# EAGLE design output stage (EAGLE 9.3.1)
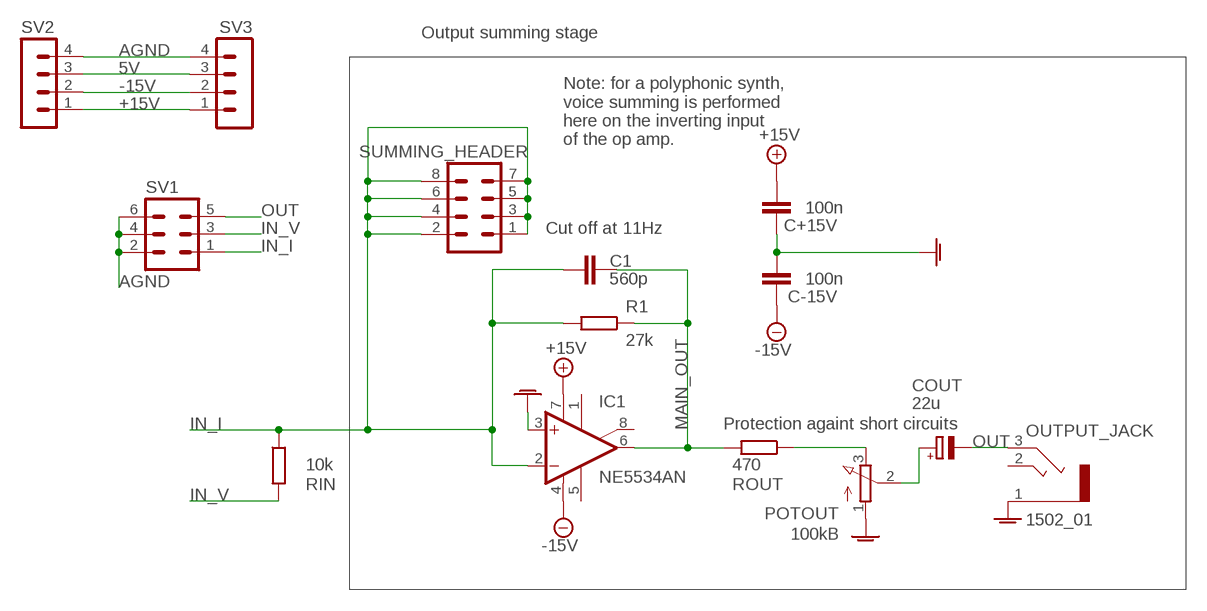
[diagram p0: schematic, sheet 1]

## Parts
C1  560p  C-EU075-032X103  [C075-032X103]
C+15V  100n  C-EU075-032X103  [C075-032X103]
C-15V  100n  C-EU075-032X103  [C075-032X103]
COUT  22u  CPOL-EUB45181A  [B45181A]
IC1  NE5534AN  [DIL08]
OUTPUT_JACK  1502_01  [1502_01]
POTOUT  100kB  3RP/1610N  [3RP/1610N]
R1  27k  R-EU_0207/10  [0207/10]
RIN  10k  R-EU_0207/10  [0207/10]
ROUT  470  R-EU_0207/12  [0207/12]
SUMMING_HEADER  MA04-2  [MA04-2]
SV1  MA03-2  [MA03-2]
SV2  MA04-1  [MA04-1]
SV3  MA04-1  [MA04-1]

## Nets
5V: SV2.3 SV3.3
+15V: C+15V.2 IC1.7(V+) SV2.1 SV3.1
-15V: C-15V.1 IC1.4(V-) SV2.2 SV3.2
AGND: C+15V.1 C-15V.2 IC1.3(+IN) OUTPUT_JACK.1 POTOUT.1(A) SV1.2 SV1.4 SV1.6 SV2.4 SV3.4
IN_I: C1.2 IC1.2(-IN) R1.2 RIN.1 SUMMING_HEADER.1 SUMMING_HEADER.2 SUMMING_HEADER.3 SUMMING_HEADER.4 SUMMING_HEADER.5 SUMMING_HEADER.6 SUMMING_HEADER.7 SUMMING_HEADER.8 SV1.1
IN_V: RIN.2 SV1.3
MAIN_OUT: C1.1 IC1.6(OUT) R1.1 ROUT.2
N$8: COUT.+ POTOUT.2(S)
N$9: POTOUT.3(E) ROUT.1
OUT: COUT.- OUTPUT_JACK.3 SV1.5
Unconnected: IC1.1(ON) IC1.5(CMP) IC1.8(ON/CMP) OUTPUT_JACK.2

## Notes on the sheet
- Output summing stage
- Note: for a polyphonic synth, 
  voice summing is performed 
  here on the inverting input 
  of the op amp.
- Cut off at 11Hz
- Protection againt short circuits

## Library data of the parts
C1 C+15V C-15V = rcl:C-EU: CAPACITOR, European symbol; SPICEPREFIX: C
COUT = resistor:CPOL-EU: POLARIZED CAPACITOR, European symbol
IC1 = linear:NE5534: LOW-NOISE OPERATIONAL AMPLIFIER Source: http://focus.ti.com/lit/ds/symlink/ne5534.pdf
OUTPUT_JACK = con-lumberg:1502_01: Jack connectors according to JISC 6560, 3.5 mm Klinkensteckverbinder nach JISC 6560, 3,5 mm Source: http://www.lumberg.com/Produkte/PDFs/1502_01.pdf; OC_FARNELL: 4739747; OC_NEWARK: unknown
POTOUT = pot:3RP/1610N: 16mm Potentiometer one level Source: http://www.alphapotentiometers.net/html/16mm_pot_2.html
R1 RIN ROUT = rcl:R-EU_: RESISTOR, European symbol; SPICEPREFIX: R
SUMMING_HEADER = con-lstb:MA04-2: PIN HEADER; OC_FARNELL: unknown; OC_NEWARK: unknown
SV1 = con-lstb:MA03-2: PIN HEADER; OC_FARNELL: unknown; OC_NEWARK: unknown
SV2 SV3 = con-lstb:MA04-1: PIN HEADER; OC_FARNELL: unknown; OC_NEWARK: unknown

## Board
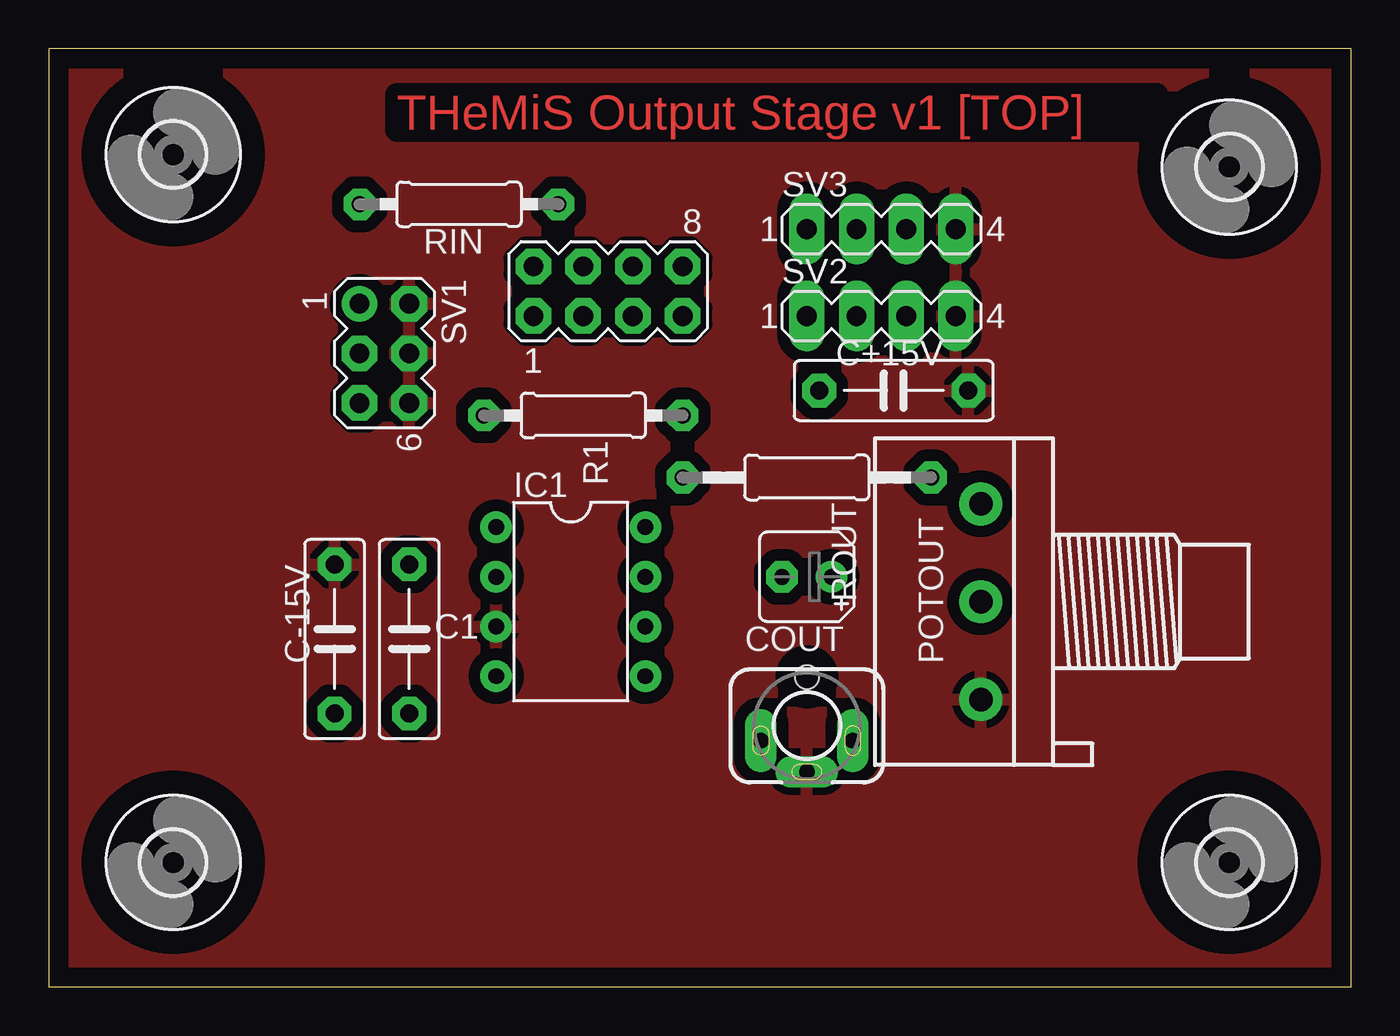
[diagram p1: board, top side]
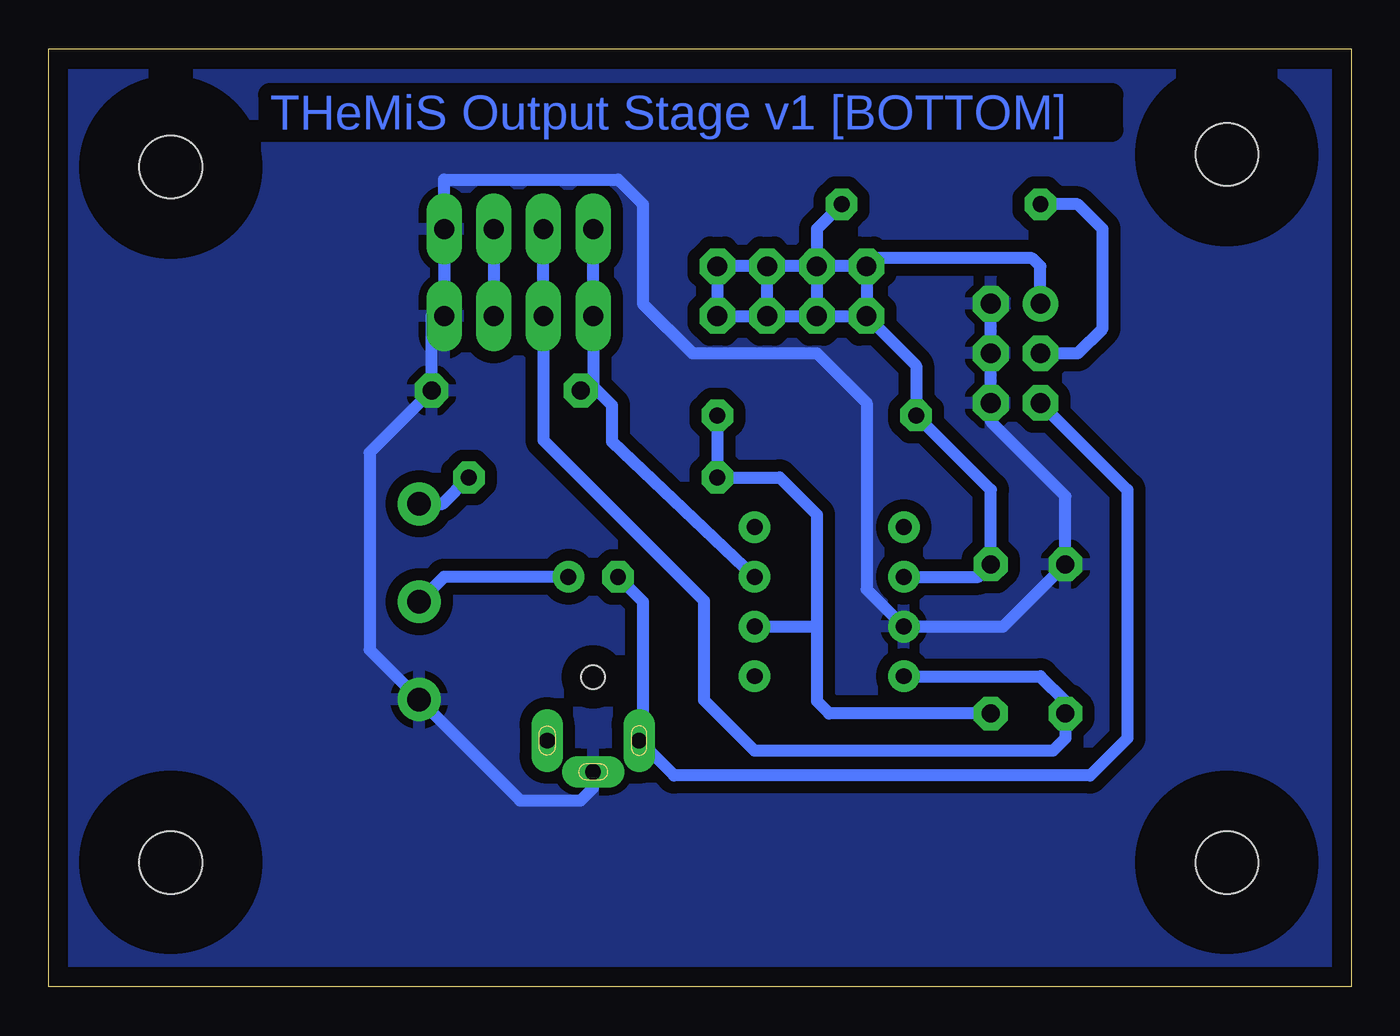
[diagram p2: board, bottom side, seen from below]

Size 66.55 x 47.95 mm. Coordinates in mm from the lower left corner, seen from the top.
Outline: 0,0 66.55,0 66.55,47.95 0,47.95 0,0
Copper layers (1*16): Top 0.035mm / dielectric 1.5mm / Bottom 0.035mm
Design rules "ENSEA_2019": minimum track width 0.4mm, minimum drill 0.6mm, track to track 0.4mm, track to pad 0.4mm, pad to pad 0.4mm, via to via 0.4mm, smd to smd 0.4mm, copper to edge 1mm, drill to drill 0.4mm, minimum pad ring 0.4mm, minimum via ring 0.4mm, stop-mask expansion 4mil, vias tented up to drill 0mil, thermal gap 0.4mm

### Footprints (pad centres in the part's own frame; a part is rotated, then mirrored left to right if it is on the bottom)
C075-032X103 = drill 0.914 octagon: 1 -3.81,0; 2 3.81,0
B45181A = drill 0.813 pad 1.6: + -1.27,0 | drill 0.813 pad 1.6 octagon: - 1.27,0
DIL08 = drill 0.813 pad 1.27: 1 -3.81,-3.81; 2 -1.27,-3.81; 3 1.27,-3.81; 4 3.81,-3.81; 5 3.81,3.81; 6 1.27,3.81; 7 -1.27,3.81; 8 -3.81,3.81
1502_01 = drill 0.8 pad 1.2 long: 1 0,2.35; 2 -2.35,0.75; 3 2.35,0.75 | hole 1.2: 0,-2.5
3RP/1610N = drill 1.2 pad 2.184: 1 -5,0; 2 0,0; 3 5,0
0207/10 = drill 0.813 octagon: 1 -5.08,0; 2 5.08,0
0207/12 = drill 0.813 octagon: 1 -6.35,0; 2 6.35,0
MA04-2 = drill 1.016 octagon: 1 -3.81,-1.27; 2 -3.81,1.27; 3 -1.27,-1.27; 4 -1.27,1.27; 5 1.27,-1.27; 6 1.27,1.27; 7 3.81,-1.27; 8 3.81,1.27
MA03-2 = drill 1.016: 1 -2.54,-1.27 | drill 1.016 octagon: 2 -2.54,1.27; 3 0,-1.27; 4 0,1.27; 5 2.54,-1.27; 6 2.54,1.27
MA04-1 = drill 1.016 long: 1 -3.81,0; 2 -1.27,0; 3 1.27,0; 4 3.81,0
3,2 = hole 3.2: 0,0

### Placement (x,y rotation side)
C1  18.41,17.78 90 top
C+15V  43.18,30.48 180 top
C-15V  14.61,17.78 90 top
COUT  38.73,20.95 180 top
IC1  26.67,19.69 270 top
OUTPUT_JACK  38.73,13.33 180 top
POTOUT  47.62,19.69 90 top
R1  27.3,29.21 180 top
RIN  20.95,40 180 top
ROUT  38.73,26.03 180 top
SUMMING_HEADER  28.58,35.56 0 top
SV1  17.14,32.38 270 top
SV2  42.55,34.29 0 top
SV3  42.55,38.73 0 top
U$1  [3,2]  60.32,41.91 0 top
U$2  [3,2]  6.35,6.35 0 top
U$3  [3,2]  60.32,6.35 0 top
U$4  [3,2]  6.35,42.54 0 top

### Tracks (layer width: path | path; a pad name or v marks a point on that pad's centre or on a via)
5V
  Bottom 0.61: SV3.3 SV2.3
+15V
  Bottom 0.61: 38.73,30.69 SV2.1 SV3.1 | 38.73,30.69 37.77,29.72 37.77,27.87 IC1.7 | C+15V.2 39.16,30.69 38.73,30.69
-15V
  Bottom 0.61: SV3.2 SV2.2 41.27,27.94 33.06,19.73 33.06,14.64 30.48,12.06 15.24,12.06 14.61,12.7 C-15V.1 14.61,14.6 15.88,15.87 IC1.4
AGND
  Bottom 0.61: SV1.2 SV1.4 SV1.6 18.41,28.9 14.61,25.09 C-15V.2 17.78,18.41 IC1.3 24.77,20.32 24.77,29.84 27.3,32.38 33.66,32.38 36.2,34.92 36.2,40 37.46,41.27 46.35,41.27 SV3.4 SV2.4 46.99,34.29 C+15V.1 50.16,27.3 50.16,17.23 POTOUT.1 42.46,9.53 39.37,9.53 38.73,10.16 OUTPUT_JACK.1
  pour Top (isolate 0.61): 0.63,46.99 66.04,46.99 66.04,0.63 1.9,0.63 0.63,0.63
  pour Bottom (isolate 0.61): 0.63,46.99 66.04,46.99 66.04,0.63 0.63,0.63
IN_I
  Bottom 0.61: SV1.1 15.88,36.83 16.29,37.25 24.34,37.25 SUMMING_HEADER.2 | SUMMING_HEADER.4 SUMMING_HEADER.3 | SUMMING_HEADER.2 SUMMING_HEADER.4 | SUMMING_HEADER.4 SUMMING_HEADER.6 | SUMMING_HEADER.6 SUMMING_HEADER.8 SUMMING_HEADER.7 SUMMING_HEADER.5 | SUMMING_HEADER.5 SUMMING_HEADER.6 | SUMMING_HEADER.5 SUMMING_HEADER.3 | SUMMING_HEADER.3 SUMMING_HEADER.1 | RIN.1 27.3,38.73 SUMMING_HEADER.4 | SUMMING_HEADER.1 22.23,31.75 R1.2 18.41,25.4 C1.2 19.05,20.95 IC1.2 | SUMMING_HEADER.2 SUMMING_HEADER.1
IN_V
  Bottom 0.61: SV1.3 13.97,32.38 12.7,33.65 12.7,38.73 13.97,40 RIN.2
MAIN_OUT
  Bottom 0.61: C1.1 26.67,13.97 27.3,14.6 27.3,18.41 | R1.1 ROUT.2 29.21,26.03 27.3,24.13 27.3,18.41 | IC1.6 27.3,18.41
N$8
  Bottom 0.61: COUT.+ 46.35,20.95 POTOUT.2
N$9
  Bottom 0.61: POTOUT.3 46.44,24.68 ROUT.1
OUT
  Bottom 0.61: COUT.- 36.2,19.69 36.2,12.39 OUTPUT_JACK.3 34.59,10.79 13.34,10.79 11.43,12.7 11.43,25.4 SV1.5

### Text on the board
Top: THeMiS Output Stage v1 [TOP]
Bottom: THeMiS Output Stage v1 [BOTTOM]